# Altium schematic sheet 传感器.SchDoc: 传感器
size A4; Organization: Altium Limited; Address1: L3, 12a Rodborough Rd; Address2: Frenchs Forest; Address3: NSW; Address4: Australia 2086; DocumentNumber: 5; Revision: V1.0; SheetNumber: 5; SheetTotal: 6; Designer: 樊浩柏
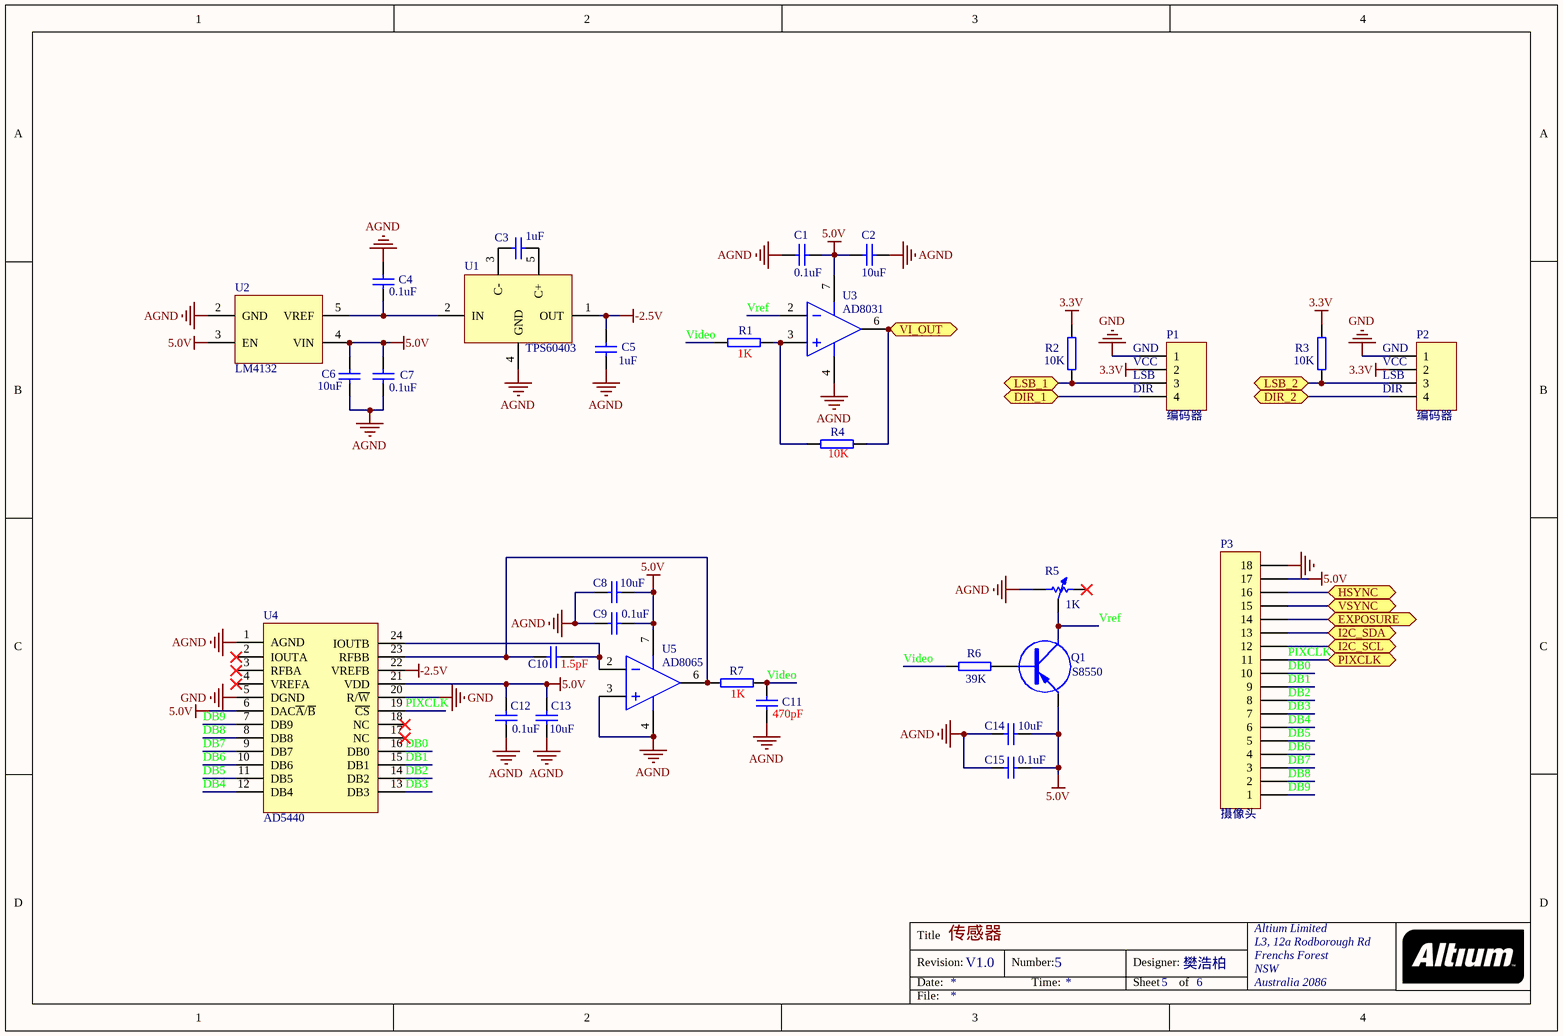
[diagram p0: 传感器.SchDoc]

## Parts
C1  0.1uF  [CAP-0603]
C2  10uF  [CAP-0603]
C3  1uF  [CAP-0603]
C4  0.1uF  [CAP-0603]
C5  1uF  [CAP-0603]
C6  10uF  [CAP-0603]
C7  0.1uF  [CAP-0603]
C8  10uF  [CAP-0603]
C9  0.1uF  [CAP-0603]
C10  1.5pF  [CAP-0603]
C11  470pF  [CAP-0603]
C12  0.1uF  [CAP-0603]
C13  10uF  [CAP-0603]
C14  10uF  [CAP-0603]
C15  0.1uF  [CAP-0603]
P1  编码器  [Pin-Header-2.54-Single-4]
P2  编码器  [Pin-Header-2.54-Single-4]
P3  摄像头  [Header-FPC-ZIF-SMD-Vertical Single-0.5-18]
Q1  S8550  [SOT-23-3]
R1  1K  [RES-0603]
R2  10K  [RES-0603]
R3  10K  [RES-0603]
R4  10K  [RES-0603]
R5  1K  [RES-Adj_PVZ3]
R6  39K  [RES-0603]
R7  1K  [RES-0603]
U1  TPS60403  [SOT-23-5]
U2  LM4132  [SOT-23-5]
U3  AD8031  [SOT-23-5]
U4  AD5440  [TSSOP-24]
U5  AD8065  [SOT-23-5]

## Ports
DIR_1, DIR_2, EXPOSURE, HSYNC, I2C_SCL, I2C_SDA, LSB_1, LSB_2, PIXCLK, VI_OUT, VSYNC

## Nets
3.3V: P1.2 P2.2 R2.2 R3.2
5.0V: C1.1 C2.1 C6.1 C7.1 C8.1 C9.1 C12.2 C13.2 C14.1 C15.1 P3.17 Q1.2(E) U2.3(EN) U2.4(VIN) U3.7(V+) U4.6(DAC~{A}/~{B}) U4.21(VDD) U5.7(V+)
-2.5V: C5.1 U1.1(OUT) U4.22(VREFB)
AGND: C1.2 C2.2 C4.2 C5.2 C6.2 C7.2 C8.2 C9.2 C11.2 C12.1 C13.1 C14.2 C15.2 R5.1 U1.4(GND) U2.2(GND) U3.4(V-) U4.1(AGND) U5.3(IN+) U5.4(V-)
GND: P1.1 P2.1 P3.18 U4.5(DGND) U4.20(R/~{W})
DB0: P3.10 U4.16(DB0)
DB1: P3.9 U4.15(DB1)
DB2: P3.8 U4.14(DB2)
DB3: P3.7 U4.13(DB3)
DB4: P3.6 U4.12(DB4)
DB5: P3.5 U4.11(DB5)
DB6: P3.4 U4.10(DB6)
DB7: P3.3 U4.9(DB7)
DB8: P3.2 U4.8(DB8)
DB9: P3.1 U4.7(DB9)
DIR_1: P1.4 ; port DIR_1
DIR_2: P2.4 ; port DIR_2
EXPOSURE: P3.14 ; port EXPOSURE
HSYNC: P3.16 ; port HSYNC
I2C_SCL: P3.12 ; port I2C_SCL
I2C_SDA: P3.13 ; port I2C_SDA
LSB_1: P1.3 R2.1 ; port LSB_1
LSB_2: P2.3 R3.1 ; port LSB_2
PIXCLK: P3.11 U4.19(~{CS}) ; port PIXCLK
VI_OUT: R4.1 U3.6(OUT) ; port VI_OUT
Video: C11.1 R1.2 R6.1 R7.1
Vref: Q1.3(C) R5.2 U3.2(IN-)
VSYNC: P3.15 ; port VSYNC
NetC3_1: C3.1 U1.5(C+)
NetC3_2: C3.2 U1.3(C-)
NetC4_1: C4.1 U1.2(IN) U2.5(VREF)
NetC10_1: C10.1 U4.24(IOUTB) U5.2(IN-)
NetC10_2: C10.2 R7.2 U4.23(RFBB) U5.6(OUT)
NetQ1_1: Q1.1(B) R6.2
NetR1_1: R1.1 R4.2 U3.3(IN+)

Not connected (* = marked no-connect by the designer): R5 3*; U4 2(IOUTA)* 3(RFBA)* 4(VREFA)* 17(NC)* 18(NC)*

## Notes on the sheet
- (near P1) GND
- (near P1) VCC
- (near P1) LSB
- (near P2) GND
- (near P2) VCC
- (near P2) LSB
- (near P1) DIR
- (near P2) DIR
- Title
- Revision:
- Date:
- Number:
- Time:
- Designer:
- Sheet
- of
- File:

## Library data of the parts
C1-C15 = Cap
P1 P2 = CON-4X1
P3 = CON-18X1
Q1 = PNP
R1-R4 R6 R7 = Res
R5 = Res-Adj
U3 U5 = Op Amp_AD8065: pin to pad: 2>4 4>2 6>1 7>5